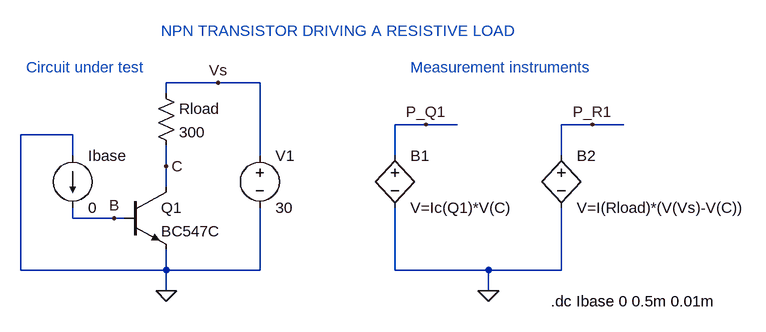
[diagram p0: schematic bc547_load.asc]
bc547_load.asc, the LTspice schematic file:
Version 4
SHEET 1 1156 680
WIRE 304 -32 224 -32
WIRE 368 -32 304 -32
WIRE 224 -16 224 -32
WIRE 624 32 576 32
WIRE 672 32 624 32
WIRE 880 32 832 32
WIRE 928 32 880 32
WIRE 80 48 0 48
WIRE 80 80 80 48
WIRE 368 80 368 -32
WIRE 576 80 576 32
WIRE 832 80 832 32
WIRE 224 96 224 64
WIRE 224 128 224 96
WIRE 80 176 80 160
WIRE 144 176 80 176
WIRE 160 176 144 176
WIRE 0 256 0 48
WIRE 224 256 224 224
WIRE 224 256 0 256
WIRE 368 256 368 160
WIRE 368 256 224 256
WIRE 576 256 576 160
WIRE 720 256 576 256
WIRE 832 256 832 160
WIRE 832 256 720 256
WIRE 224 288 224 256
WIRE 720 288 720 256
FLAG 224 288 0
FLAG 224 96 C
FLAG 144 176 B
FLAG 624 32 P_Q1
FLAG 880 32 P_R1
FLAG 304 -32 Vs
FLAG 720 288 0
SYMBOL npn2 160 128 R0
SYMATTR InstName Q1
SYMATTR Value BC547C
SYMBOL voltage 368 64 R0
SYMATTR InstName V1
SYMATTR Value 30
SYMBOL current 80 80 R0
SYMATTR InstName Ibase
SYMATTR Value 0
SYMBOL res 208 -32 R0
SYMATTR InstName Rload
SYMATTR Value 300
SYMBOL bv 576 64 R0
SYMATTR InstName B1
SYMATTR Value V=Ic(Q1)*V(C)
SYMBOL bv 832 64 R0
SYMATTR InstName B2
SYMATTR Value V=I(Rload)*(V(Vs)-V(C))
TEXT 816 304 Left 2 !.dc Ibase 0 0.5m 0.01m
TEXT 600 -56 Left 2 ;Measurement instruments
TEXT 8 -56 Left 2 ;Circuit under test
TEXT 216 -112 Left 2 ;NPN TRANSISTOR DRIVING A RESISTIVE LOAD

The netlist it stands for:
* bc547_load.asc
Q1 C B 0 0 BC547C
V1 Vs 0 30
Ibase 0 B 0
Rload Vs C 300
B1 P_Q1 0 V=Ic(Q1)*V(C)
B2 P_R1 0 V=I(Rload)*(V(Vs)-V(C))
.model NPN NPN
.model PNP PNP
.lib standard.bjt
.dc Ibase 0 0.5m 0.01m
* Measurement instruments
* Circuit under test
* NPN TRANSISTOR DRIVING A RESISTIVE LOAD
.backanno
.end